# EAGLE design tick-box-1591A-mk-4.0 (EAGLE 6.5.0)
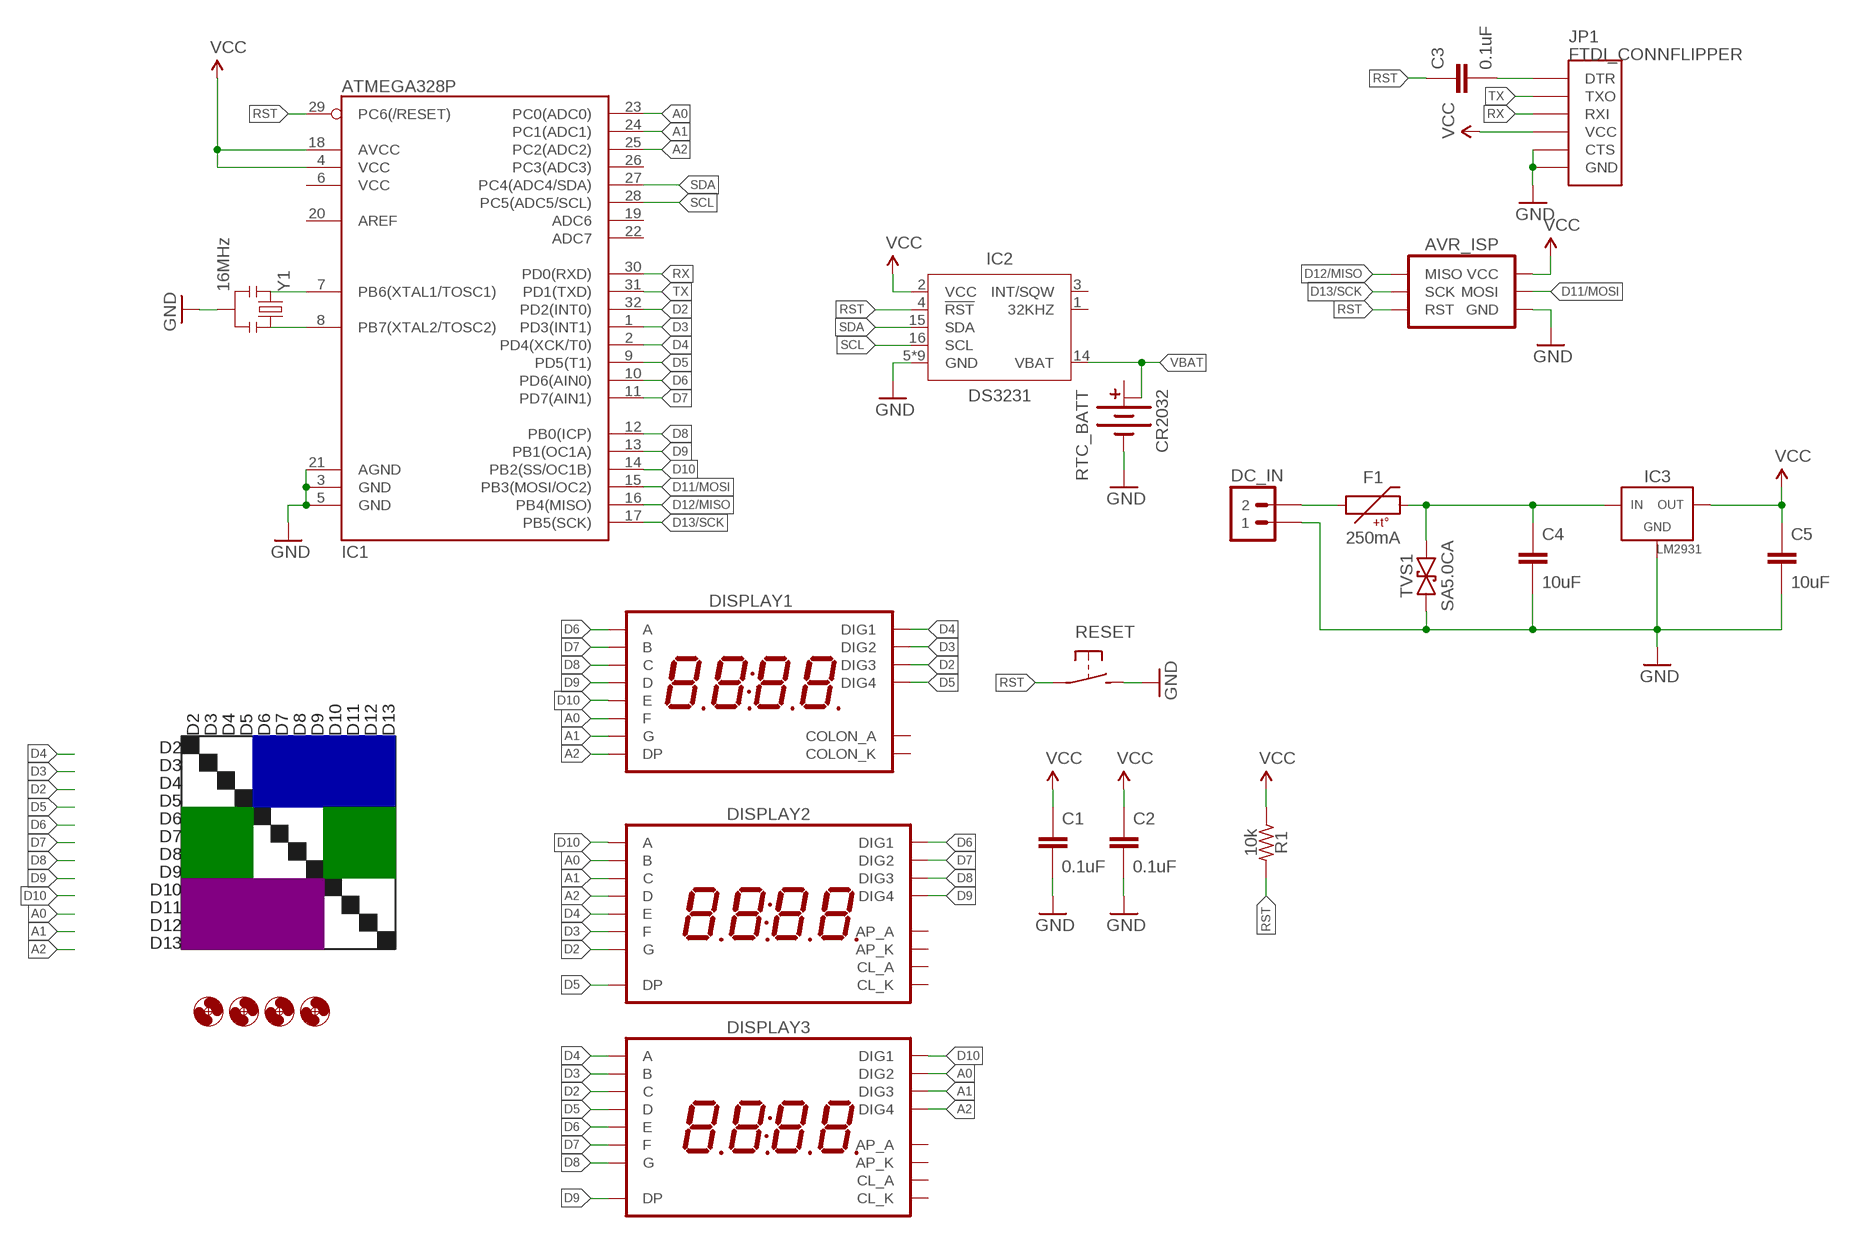
[diagram p0: schematic, sheet 1]

## Parts
AVR_ISP  AVR_SPI_PRG_6PTH  [2X3]
C1  0.1uF  CAPACITOR-CERAMICC0603  [C0603]
C2  0.1uF  CAPACITOR-CERAMICC0603  [C0603]
C3  0.1uF  CAPACITOR-CERAMICC0603  [C0603]
C4  10uF  CAPACITOR-CERAMICC1206  [C1206]
C5  10uF  CAPACITOR-CERAMICC1206  [C1206]
DC_IN  M02PTH  [1X02]
DISPLAY1  7SEG_4DIGIT_COLON14.2MM-CC-NS  [7SEG_4DIG_NS]
DISPLAY2  7SEG_4DIGIT_COLON_APOS  [7SEG_4DIG_10MM]
DISPLAY3  7SEG_4DIGIT_COLON_APOS  [7SEG_4DIG_10MM]
F1  250mA  PTCSMD  [PTC-1206]
H1  HOLE#2  [HOLE-#2]
H2  HOLE#2  [HOLE-#2]
H3  HOLE#2  [HOLE-#2]
H4  HOLE#2  [HOLE-#2]
IC1  ATMEGA328P  ATMEGA328_SMT  [TQFP32-08]
IC2  DS3231  [SO16W]
IC3  LM2931  LM2931-FIXED  [SO08]
JP1  FTDI_CONNFLIPPER  [FTDI_CONN_FLIP]
R1  10k  RESISTORR0603  [R0603]
RESET  SPST-NO-TACT3MM-PTH-SMALL-PADS  [DTS-3-SMALL-PADS]
RTC_BATT  CR2032  BATTERY-COINCR2032_SMD  [BATTCON_20MM_MINE]
TVS1  SA5.0CA  TVSSMA  [SMA-DIODE-TVS-BIDIR]
Y1  16MHz  RESONATORCSTCE_V  [CSTCE_V_RESONATOR]

## Nets
A0: DISPLAY1.P$12(F) DISPLAY2.16(B) DISPLAY3.2(DIG2) IC1.23(PC0(ADC0))
A1: DISPLAY1.P$5(G) DISPLAY2.13(C) DISPLAY3.6(DIG3) IC1.24(PC1(ADC1))
A2: DISPLAY1.P$3(DP) DISPLAY2.3(D) DISPLAY3.8(DIG4) IC1.25(PC2(ADC2))
D2: DISPLAY1.P$10(DIG3) DISPLAY2.15(G) DISPLAY3.13(C) IC1.32(PD2(INT0))
D3: DISPLAY1.P$11(DIG2) DISPLAY2.11(F) DISPLAY3.16(B) IC1.1(PD3(INT1))
D4: DISPLAY1.P$14(DIG1) DISPLAY2.5(E) DISPLAY3.14(A) IC1.2(PD4(XCK/T0))
D5: DISPLAY1.P$6(DIG4) DISPLAY2.7(DP) DISPLAY3.3(D) IC1.9(PD5(T1))
D6: DISPLAY1.P$13(A) DISPLAY2.1(DIG1) DISPLAY3.5(E) IC1.10(PD6(AIN0))
D7: DISPLAY1.P$9(B) DISPLAY2.2(DIG2) DISPLAY3.11(F) IC1.11(PD7(AIN1))
D8: DISPLAY1.P$4(C) DISPLAY2.6(DIG3) DISPLAY3.15(G) IC1.12(PB0(ICP))
D9: DISPLAY1.P$2(D) DISPLAY2.8(DIG4) DISPLAY3.7(DP) IC1.13(PB1(OC1A))
D10: DISPLAY1.P$1(E) DISPLAY2.14(A) DISPLAY3.1(DIG1) IC1.14(PB2(SS/OC1B))
D11/MOSI: AVR_ISP.4(MOSI) IC1.15(PB3(MOSI/OC2))
D12/MISO: AVR_ISP.1(MISO) IC1.16(PB4(MISO))
D13/SCK: AVR_ISP.3(SCK) IC1.17(PB5(SCK))
GND: AVR_ISP.6(GND) C1.2 C2.2 C4.2 C5.2 DC_IN.1 IC1.3(GND) IC1.5(GND) IC1.21(AGND) IC2.5(GND) IC2.6(GND) IC2.7(GND) IC2.8(GND) IC2.9(GND) IC2.10(GND) IC2.11(GND) IC2.12(GND) IC2.13(GND) IC3.2(GND) IC3.3(GND) IC3.4(GND) IC3.5(GND) IC3.6(GND) IC3.7(GND) JP1.CTS JP1.GND RESET.2 RTC_BATT.BOTTOM(-) TVS1.1 Y1.2
N$1: IC1.7(PB6(XTAL1/TOSC1)) Y1.3
N$2: IC1.8(PB7(XTAL2/TOSC2)) Y1.1
N$4: DC_IN.2 F1.1
N$5: C4.1 F1.2 IC3.8(IN) TVS1.2
N$7: C3.2 JP1.DTR
RST: AVR_ISP.5(RST) C3.1 IC1.29(PC6(/RESET)) IC2.4(!RST) R1.2 RESET.1
RX: IC1.30(PD0(RXD)) JP1.RXI
SCL: IC1.28(PC5(ADC5/SCL)) IC2.16(SCL)
SDA: IC1.27(PC4(ADC4/SDA)) IC2.15(SDA)
TX: IC1.31(PD1(TXD)) JP1.TXO
VBAT: IC2.14(VBAT) RTC_BATT.TOP@2(+1)
VCC: AVR_ISP.2(VCC) C1.1 C2.1 C5.1 IC1.4(VCC) IC1.18(AVCC) IC2.2(VCC) IC3.1(OUT) JP1.VCC R1.1
Unconnected: DISPLAY1.P$7(COLON_K) DISPLAY1.P$8(COLON_A) DISPLAY2.4(CL_A) DISPLAY2.9(AP_K) DISPLAY2.10(AP_A) DISPLAY2.12(CL_K) DISPLAY3.4(CL_A) DISPLAY3.9(AP_K) DISPLAY3.10(AP_A) DISPLAY3.12(CL_K) IC1.6(VCC) IC1.19(ADC6) IC1.20(AREF) IC1.22(ADC7) IC1.26(PC3(ADC3)) IC2.1(32KHZ) IC2.3(INT/SQW) RTC_BATT.TOP@1(+)

## Notes on the sheet
- D2 | D3 | D4 | D5 | D6 | D7 | D8 | D9 | D10 | D11 | D12 | D13
- D2
- D3
- D4
- D5
- D6
- D7
- D8
- D9
- D10
- D11
- D12
- D13

## Library data of the parts
AVR_ISP = A_butts:AVR_SPI_PRG_6: AVR ISP 6 Pin This is the reduced ISP connector for AVR programming. Common on Arduino. This footprint will take up less PCB space and can be used with a 10-pin to 6-pin adapter such as SKU: BOB-08508 **Special note about "TEST_POINT" package. The stop mask is on the top side, so if you want your programming test points to be on the bottom of your board, make sure to place this package on the bottom side of the board. This also ensure that the orientation to program from the bottom side will be correct.
C1-C5 = A_butts:CAPACITOR-CERAMIC: CAPACITOR, European symbol
DC_IN = A_butts:M02: Standard 2-pin 0.1" header. Use with - straight break away headers ( PRT-00116) - right angle break away headers (PRT-00553) - swiss pins (PRT-00743) - machine pins (PRT-00117) - female headers (PRT-00115) Molex polarized connector foot print use with: PRT-08233 with associated crimp pins and housings. 2.54_SCREWTERM for use with PRT-10571. 3.5mm Screw Terminal footprints for PRT-08084 5mm Screw Terminal footprints for use with PRT-08433
DISPLAY1 = A_butts:7SEG_4DIGIT_COLON
DISPLAY2 DISPLAY3 = A_butts:7SEG_4DIGIT_COLON_APOS
F1 = A_butts:PTC: Resettable Fuse PTC Resettable Fuse. Spark Fun Electronics SKU : COM-08357; PROD_ID: RES-11150
H1-H4 = A_butts:HOLE: MOUNTING HOLE with drill center marker
IC1 = A_butts:ATMEGA328_SMT: 32-Pin Atmega328 part Commonly used on Arduino compatible boards Available in QFP and QFN packages TQFP is IC-09069 QFN is non-stock; PROD_ID: IC-09069
IC2 = A_butts:DS3231
IC3 = A_butts:LM2931-FIXED
JP1 = A_butts:FTDI_CONN: Connector which mates to FTDI basic or FTDI cable.
R1 = A_butts:RESISTOR: RESISTOR, American symbol
RESET = A_butts:SPST-NO-TACT
RTC_BATT = A_butts:BATTERY-COIN
TVS1 = A_butts:TVS: Transient voltage suppressor- prevents ESD on inputs. Ignore package description- MBRA140 is NOT this type of part!!!
Y1 = A_butts:RESONATOR: Resonator Small SMD resonator. Used, eg, on the Arduino Pro/ Pro Mini boards. 8MHz- XTAL-08895 16MHz- XTAL-08900

## Board
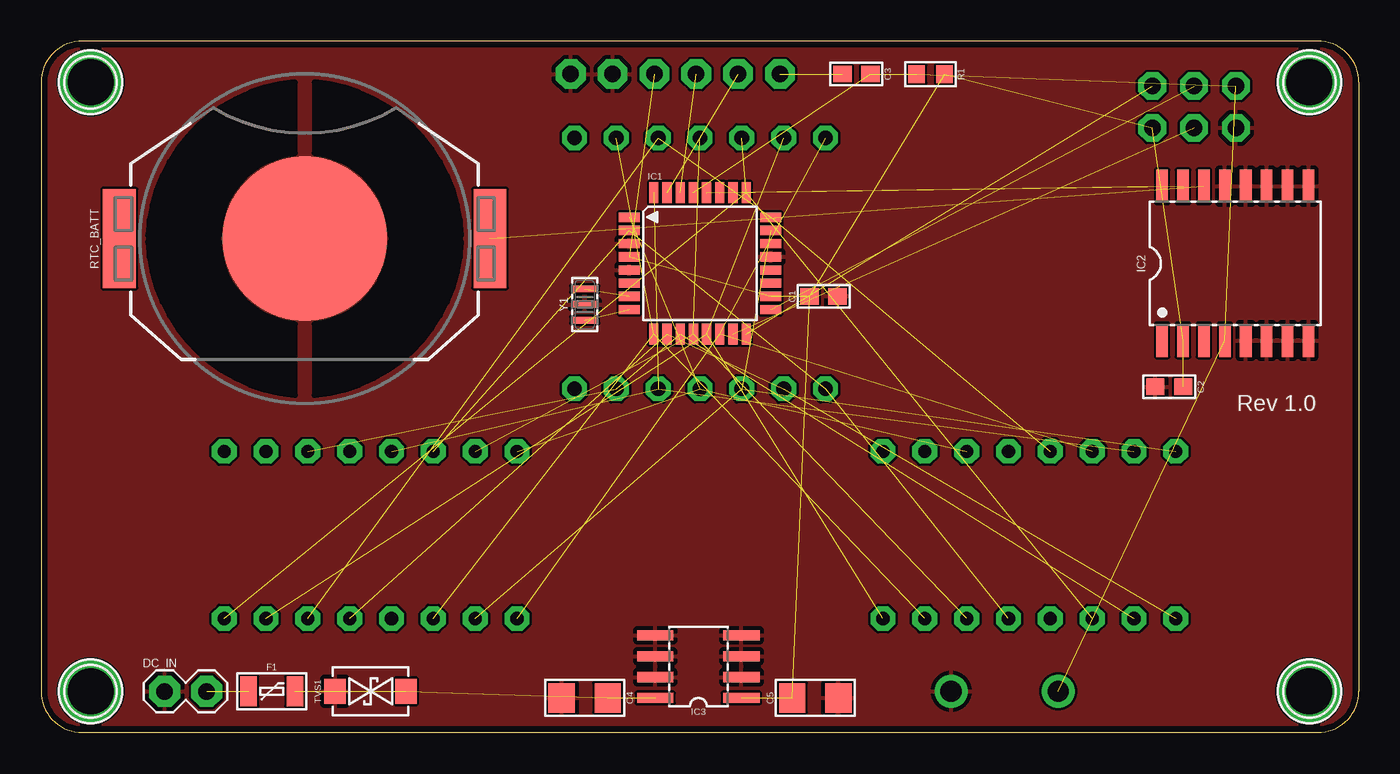
[diagram p1: board, top side]
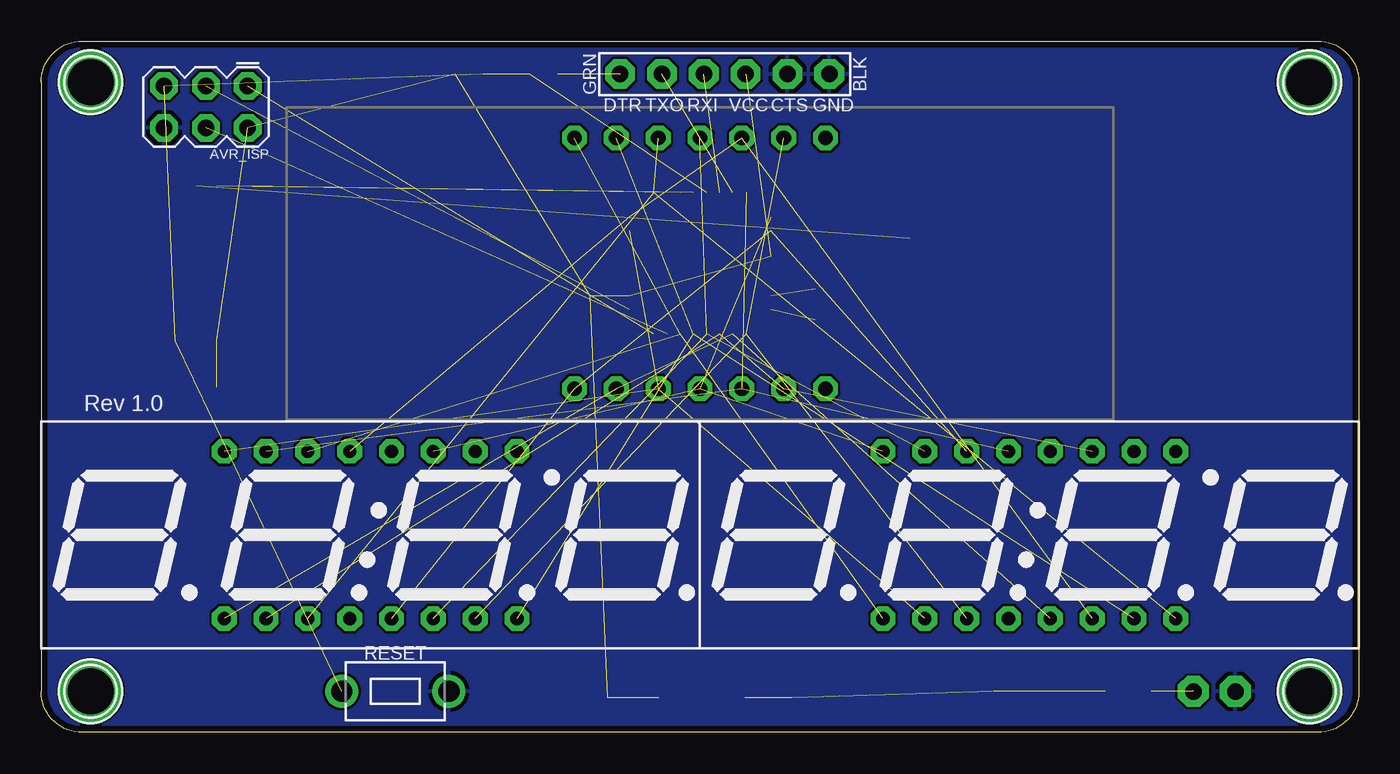
[diagram p2: board, bottom side, seen from below]

Size 80 x 42 mm. Coordinates in mm from the lower left corner, seen from the top.
Outline: 80,39.5 arc90 77.5,42 2.5,42 arc90 0,39.5 0,2.5 arc90 2.5,0 77.5,0 arc90 80,2.5 80,39.5
Copper layers (1*16): Top 0.0356mm / dielectric 1.5011mm / Bottom 0.0356mm
Design rules "LaenPCBOrder_2": minimum track width 6mil, minimum drill 13mil, track to track 6mil, track to pad 6mil, pad to pad 6mil, via to via 6mil, smd to smd 6mil, copper to edge 15mil, drill to drill 6mil, minimum pad ring 7mil, minimum via ring 7mil, stop-mask expansion 3mil, vias tented up to drill 20mil, thermal gap 10mil

### Footprints (pad centres in the part's own frame; a part is rotated, then mirrored left to right if it is on the bottom)
2X3 = drill 1 pad 1.676 octagon: 1 -2.54,-1.27; 2 -2.54,1.27; 3 0,-1.27; 4 0,1.27; 5 2.54,-1.27; 6 2.54,1.27
C0603 = smd 1.1 x 1: 1 -0.85,0; 2 0.85,0
C1206 = smd 1.6 x 1.8: 1 -1.4,0; 2 1.4,0
1X02 = drill 1 pad 1.88 octagon: 1 0,0; 2 2.54,0
7SEG_4DIG_NS = drill 0.9 pad 1.5 octagon: P$1 -7.62,7.62; P$2 -5.08,7.62; P$3 -2.54,7.62; P$4 0,7.62; P$5 2.54,7.62; P$6 5.08,7.62; P$7 7.62,7.62; P$8 7.62,-7.62; P$9 5.08,-7.62; P$10 2.54,-7.62; P$11 0,-7.62; P$12 -2.54,-7.62; P$13 -5.08,-7.62; P$14 -7.62,-7.62
7SEG_4DIG_10MM = drill 0.8 pad 1.5 octagon: 1 -8.89,-5.08; 2 -6.35,-5.08; 3 -3.81,-5.08; 4 -1.27,-5.08; 5 1.27,-5.08; 6 3.81,-5.08; 7 6.35,-5.08; 8 8.89,-5.08; 9 8.89,5.08; 10 6.35,5.08; 11 3.81,5.08; 12 1.27,5.08; 13 -1.27,5.08; 14 -3.81,5.08; 15 -6.35,5.08; 16 -8.89,5.08
PTC-1206 = smd 1 x 1.8: 1 -1.4,0; 2 1.4,0
HOLE-#2 = drill 2.8 pad 3.81: P$1 0,0
TQFP32-08 = smd 1.27 x 0.559: 1 -4.293,2.8; 2 -4.293,2; 3 -4.293,1.2; 4 -4.293,0.4; 5 -4.293,-0.4; 6 -4.293,-1.2; 7 -4.293,-2; 8 -4.293,-2.8; 17 4.293,-2.8; 18 4.293,-2; 19 4.293,-1.2; 20 4.293,-0.4; 21 4.293,0.4; 22 4.293,1.2; 23 4.293,2; 24 4.293,2.8 | smd 0.559 x 1.27: 9 -2.8,-4.293; 10 -2,-4.293; 11 -1.2,-4.293; 12 -0.4,-4.293; 13 0.4,-4.293; 14 1.2,-4.293; 15 2,-4.293; 16 2.8,-4.293; 25 2.8,4.293; 26 2,4.293; 27 1.2,4.293; 28 0.4,4.293; 29 -0.4,4.293; 30 -1.2,4.293; 31 -2,4.293; 32 -2.8,4.293
SO16W = smd 0.7 x 2: 1 -4.445,-4.685; 2 -3.175,-4.685; 3 -1.905,-4.685; 4 -0.635,-4.685; 5 0.635,-4.685; 6 1.905,-4.685; 7 3.175,-4.685; 8 4.445,-4.685; 9 4.445,4.685; 10 3.175,4.685; 11 1.905,4.685; 12 0.635,4.685; 13 -0.635,4.685; 14 -1.905,4.685; 15 -3.175,4.685; 16 -4.445,4.685
SO08 = smd 0.61 x 2.21: 1 -1.905,-2.616; 2 -0.635,-2.616; 3 0.635,-2.616; 4 1.905,-2.616; 5 1.905,2.616; 6 0.635,2.616; 7 -0.635,2.616; 8 -1.905,2.616
FTDI_CONN_FLIP = drill 1 pad 1.8 octagon: CTS 3.81,0; DTR -6.35,0; GND 6.35,0; RXI -1.27,0; TXO -3.81,0; VCC 1.27,0
R0603 = smd 1 x 1.1: 1 -0.85,0; 2 0.85,0
DTS-3-SMALL-PADS = drill 1.3 pad 2: 1 -3.25,0; 2 3.25,0
BATTCON_20MM_MINE = smd 10 x 10: BOTTOM 0,0 | smd 6 x 2: TOP@1 0,11.25; TOP@2 0,-11.25
SMA-DIODE-TVS-BIDIR = smd 1.3 x 1.5: 1 -2.15,0; 2 2.15,0
CSTCE_V_RESONATOR = smd 0.4 x 1.6: 1 -0.95,0; 2 0,0; 3 0.95,0

### Placement (x,y rotation side)
AVR_ISP  70,38 180 bottom
C1  47.5,26.5 0 top
C2  68.5,21 180 top
C3  49.5,40 180 top
C4  33,2.1 180 top
C5  47,2.1 0 top
DC_IN  7.5,2.5 0 top
DISPLAY1  40,28.5 0 bottom
DISPLAY2  60,12 0 bottom
DISPLAY3  20,12 0 bottom
F1  14,2.5 0 top
H1  3,2.5 0 top
H2  3,39.5 0 top
H3  77,2.5 0 top
H4  77,39.5 0 top
IC1  40,28.5 0 top
IC2  72.5,28.5 0 top
IC3  39.9,4 90 top
JP1  38.5,40 0 bottom
R1  54,40 180 top
RESET  58.5,2.5 0 bottom
RTC_BATT  16,30 90 top
TVS1  20,2.5 0 top
Y1  33,26 90 top

### Tracks (layer width: path | path; a pad name or v marks a point on that pad's centre or on a via)
A0  (3 unrouted)
A1  (3 unrouted)
A2  (3 unrouted)
D2  (3 unrouted)
D3  (3 unrouted)
D4  (3 unrouted)
D5  (3 unrouted)
D6  (3 unrouted)
D7  (3 unrouted)
D8  (3 unrouted)
D9  (3 unrouted)
D10  (3 unrouted)
D11/MOSI  (1 unrouted)
D12/MISO  (1 unrouted)
D13/SCK  (1 unrouted)
GND
  pour Top: 80,2.5 arc-90 77.5,0 2.5,0 arc-90 0,2.5 0,39.5 arc-90 2.5,42 77.5,42 arc-90 80,39.5
  pour Bottom: 80,2.5 arc-90 77.5,0 2.5,0 arc-90 0,2.5 0,39.5 arc-90 2.5,42 77.5,42 arc-90 80,39.5
N$1  (1 unrouted)
N$2  (1 unrouted)
N$4  (1 unrouted)
N$5  (3 unrouted)
N$7  (1 unrouted)
RST  (5 unrouted)
RX  (1 unrouted)
SCL  (1 unrouted)
SDA  (1 unrouted)
TX  (1 unrouted)
VBAT  (1 unrouted)
VCC  (9 unrouted)